# Altium schematic sheet sensorbreakout.schdoc: Core Module
size 431 x 279 mm; DrawnBy: D. Bruey, M. Ciuffo; Organization: Synapse Product Development, LLC.; Address1: 1511 6th Ave., Suite 400; Address2: Seattle, Washington 98101; Address3: 206.381.0898; Address4: www.synapse.com; DocumentNumber: 1; SheetNumber: 1; SheetTotal: 3; PageSetup: Record=PageOptions|CenterHorizontal=True|CenterVertical=True|PrintScale=1.06|XCorrection=1.00|YCorrection=1.00|PrintKind=1|BorderSize=5000000|LeftOffset=0|BottomOffset=0|Orientation=2|PaperLength=4318|PaperWidth=2794|Scale=100|PaperSource=7|PrintQuality=200|MediaType=1|DitherType=10|PrintScaleMode=1|PaperKind=11x17|PaperIndex=3
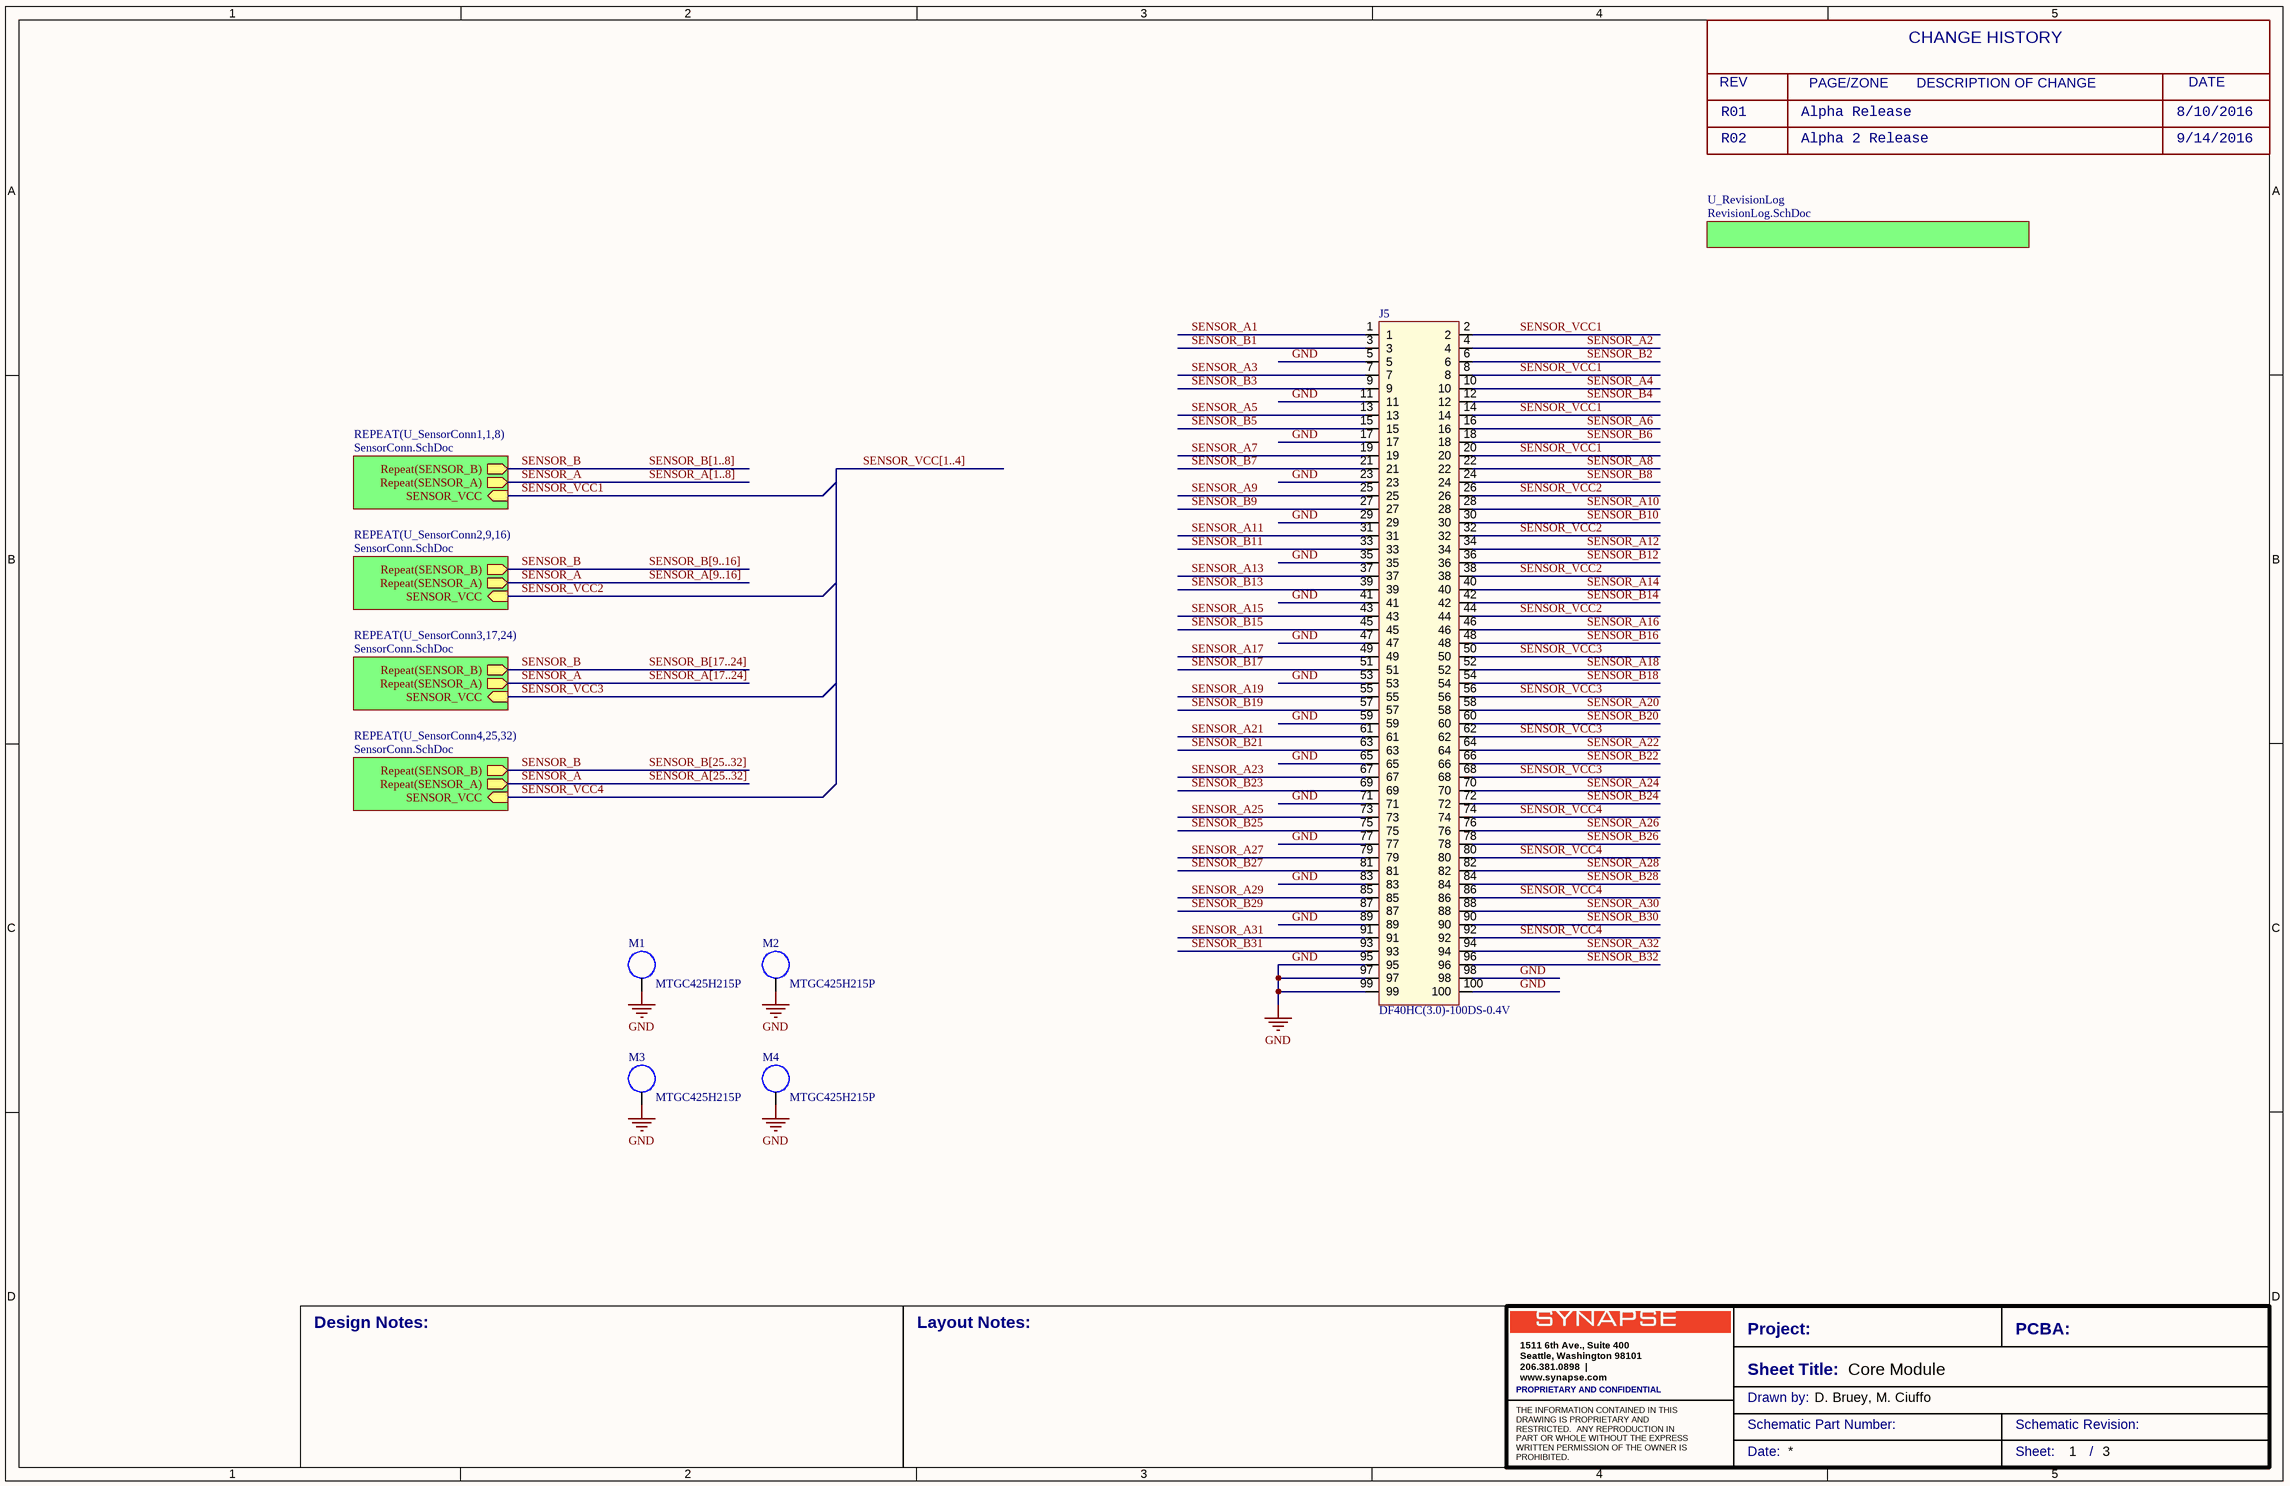
[diagram p0: sensorbreakout.schdoc]

## Parts
J5  DF40HC(3.0)-100DS-0.4V  [con100_hirose-df40c-100ds_129h]
M1  MTGC425H215P  [MTGC425H215P]  (no BOM)
M2  MTGC425H215P  [MTGC425H215P]  (no BOM)
M3  MTGC425H215P  [MTGC425H215P]  (no BOM)
M4  MTGC425H215P  [MTGC425H215P]  (no BOM)

## Sub-sheets
REPEAT(U_SensorConn1,1,8) = SensorConn.SchDoc: Repeat(SENSOR_A), Repeat(SENSOR_B), SENSOR_VCC (in)
REPEAT(U_SensorConn2,9,16) = SensorConn.SchDoc: Repeat(SENSOR_A), Repeat(SENSOR_B), SENSOR_VCC (in)
REPEAT(U_SensorConn3,17,24) = SensorConn.SchDoc: Repeat(SENSOR_A), Repeat(SENSOR_B), SENSOR_VCC (in)
REPEAT(U_SensorConn4,25,32) = SensorConn.SchDoc: Repeat(SENSOR_A), Repeat(SENSOR_B), SENSOR_VCC (in)
U_RevisionLog = RevisionLog.SchDoc: no entries

## Nets
GND: J5.5 J5.11 J5.17 J5.23 J5.29 J5.35 J5.41 J5.47 J5.53 J5.59 J5.65 J5.71 J5.77 J5.83 J5.89 J5.95 J5.97 J5.98 J5.99 J5.100 M1.1 M2.1 M3.1 M4.1
SENSOR_A: sheet REPEAT(U_SensorConn1,1,8)/Repeat(SENSOR_A), sheet REPEAT(U_SensorConn2,9,16)/Repeat(SENSOR_A), sheet REPEAT(U_SensorConn3,17,24)/Repeat(SENSOR_A), sheet REPEAT(U_SensorConn4,25,32)/Repeat(SENSOR_A)
SENSOR_A1: J5.1
SENSOR_A2: J5.4
SENSOR_A3: J5.7
SENSOR_A4: J5.10
SENSOR_A5: J5.13
SENSOR_A6: J5.16
SENSOR_A7: J5.19
SENSOR_A8: J5.22
SENSOR_A9: J5.25
SENSOR_A10: J5.28
SENSOR_A11: J5.31
SENSOR_A12: J5.34
SENSOR_A13: J5.37
SENSOR_A14: J5.40
SENSOR_A15: J5.43
SENSOR_A16: J5.46
SENSOR_A17: J5.49
SENSOR_A18: J5.52
SENSOR_A19: J5.55
SENSOR_A20: J5.58
SENSOR_A21: J5.61
SENSOR_A22: J5.64
SENSOR_A23: J5.67
SENSOR_A24: J5.70
SENSOR_A25: J5.73
SENSOR_A26: J5.76
SENSOR_A27: J5.79
SENSOR_A28: J5.82
SENSOR_A29: J5.85
SENSOR_A30: J5.88
SENSOR_A31: J5.91
SENSOR_A32: J5.94
SENSOR_B: sheet REPEAT(U_SensorConn1,1,8)/Repeat(SENSOR_B), sheet REPEAT(U_SensorConn2,9,16)/Repeat(SENSOR_B), sheet REPEAT(U_SensorConn3,17,24)/Repeat(SENSOR_B), sheet REPEAT(U_SensorConn4,25,32)/Repeat(SENSOR_B)
SENSOR_B1: J5.3
SENSOR_B2: J5.6
SENSOR_B3: J5.9
SENSOR_B4: J5.12
SENSOR_B5: J5.15
SENSOR_B6: J5.18
SENSOR_B7: J5.21
SENSOR_B8: J5.24
SENSOR_B9: J5.27
SENSOR_B10: J5.30
SENSOR_B11: J5.33
SENSOR_B12: J5.36
SENSOR_B13: J5.39
SENSOR_B14: J5.42
SENSOR_B15: J5.45
SENSOR_B16: J5.48
SENSOR_B17: J5.51
SENSOR_B18: J5.54
SENSOR_B19: J5.57
SENSOR_B20: J5.60
SENSOR_B21: J5.63
SENSOR_B22: J5.66
SENSOR_B23: J5.69
SENSOR_B24: J5.72
SENSOR_B25: J5.75
SENSOR_B26: J5.78
SENSOR_B27: J5.81
SENSOR_B28: J5.84
SENSOR_B29: J5.87
SENSOR_B30: J5.90
SENSOR_B31: J5.93
SENSOR_B32: J5.96
SENSOR_VCC1: J5.2 J5.8 J5.14 J5.20 ; sheet REPEAT(U_SensorConn1,1,8)/SENSOR_VCC
SENSOR_VCC2: J5.26 J5.32 J5.38 J5.44 ; sheet REPEAT(U_SensorConn2,9,16)/SENSOR_VCC
SENSOR_VCC3: J5.50 J5.56 J5.62 J5.68 ; sheet REPEAT(U_SensorConn3,17,24)/SENSOR_VCC
SENSOR_VCC4: J5.74 J5.80 J5.86 J5.92 ; sheet REPEAT(U_SensorConn4,25,32)/SENSOR_VCC

## Buses and harness runs
bus SENSOR_A[1..8]
bus SENSOR_A[9..16]
bus SENSOR_A[17..24]
bus SENSOR_A[25..32]
bus SENSOR_B[1..8]
bus SENSOR_B[9..16]
bus SENSOR_B[17..24]
bus SENSOR_B[25..32]
bus SENSOR_VCC[1..4]

## Notes on the sheet
- REV
- PAGE/ZONE       DESCRIPTION OF CHANGE
- CHANGE HISTORY
- DATE
- R01
- R02
- Alpha Release
- Alpha 2 Release
- 8/10/2016
- 9/14/2016
- Design Notes:
- Layout Notes:
- Project:
- Sheet Title:
- PCBA:
- PROPRIETARY AND CONFIDENTIAL
- Drawn by:
- Schematic Part Number:
- Schematic Revision:
- Date:
- Sheet:
- /

## Library data of the parts
J5 = DF40HC(3.0)-100DS-0.4V(51): CONN RCPT 100POS 0.4MM SMD GOLD 3.0MM; part_type: connector; id: 1590; mfg: Hirose; dist: Mouser; dist_pn: 798-DF40HC30100DS451; voltage: 30V; positions: 100; TableName: viewAltiumConnectors; mfg_pn: DF40HC(3.0)-100DS-0.4V(51); source_package: DF40HC(3.0)-100DS-0.4V(51); height: 3.0mm; status: Unknown; datasheet: http://www.hirose.co.jp/cataloge_hp/ed_DF40_20140305.pdf
M1-M4 = MTGC425H215P: MTG, 4.25mm PAD, 2.15mm Plated Hole; part_type: mounting; id: 1240; dist_pn: None; TableName: viewAltiumMisc; mfg_pn: MTGC425H215P; height: 0.05MM; status: Unknown